# EAGLE design elektrosluch_mini_city (EAGLE 7.5.0)
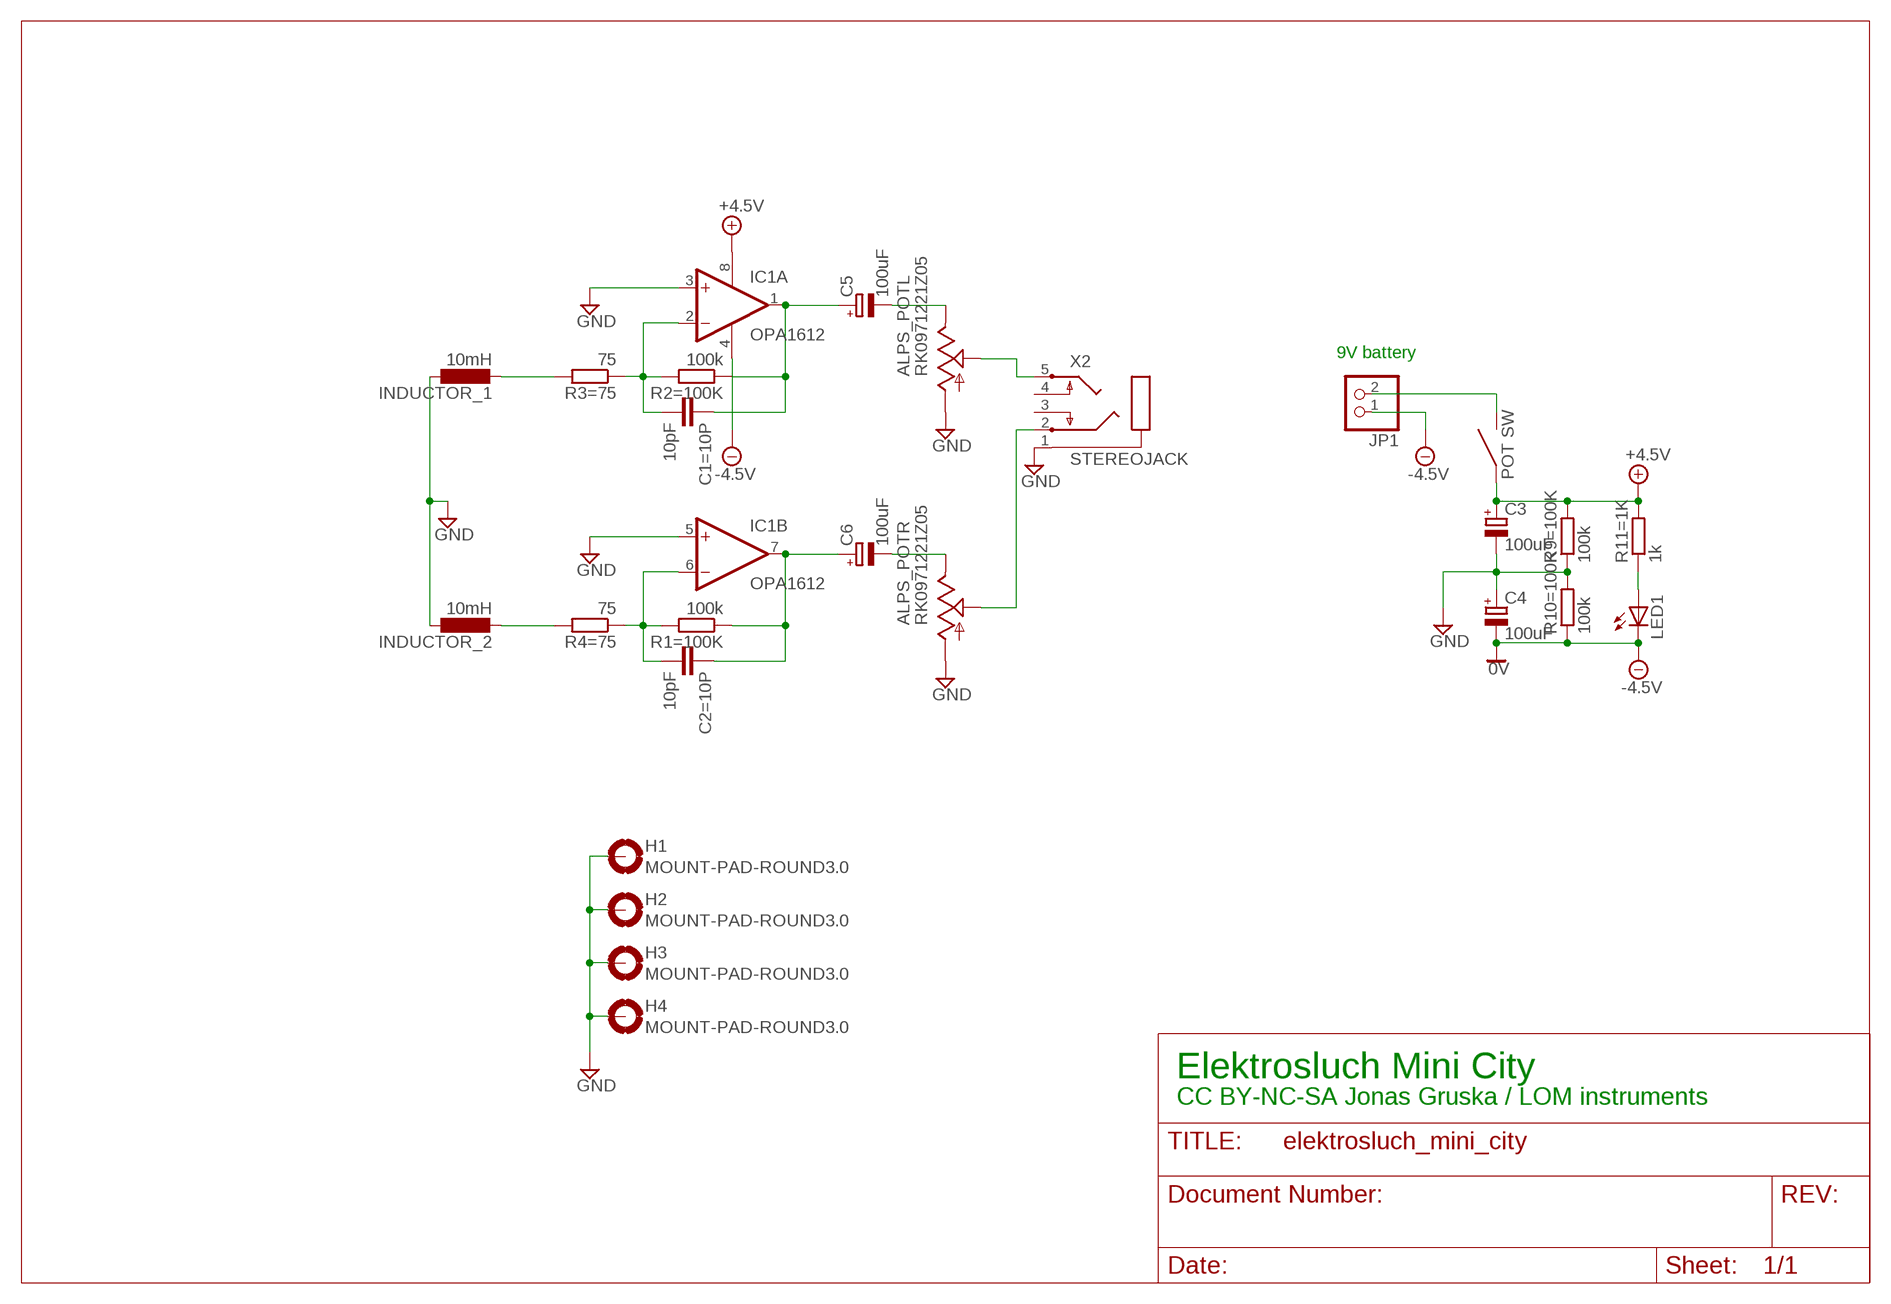
[diagram p0: schematic, sheet 1]

## Parts
ALPS_POT  RK0971221Z05  ALPS_RK0971221Z0N  [ALPS_RK0971221Z0X]
C1=10P  10pF  C-EU050-024X044  [C050-024X044]
C2=10P  10pF  C-EU050-024X044  [C050-024X044]
C3  100uF  CPOL-EUE2.5-6  [E2,5-6]
C4  100uF  CPOL-EUE2.5-6  [E2,5-6]
C5  100uF  CPOL-EUE2.5-6  [E2,5-6]
C6  100uF  CPOL-EUE2.5-6  [E2,5-6]
H1  MOUNT-PAD-ROUND3.0  [3,0-PAD]
H2  MOUNT-PAD-ROUND3.0  [3,0-PAD]
H3  MOUNT-PAD-ROUND3.0  [3,0-PAD]
H4  MOUNT-PAD-ROUND3.0  [3,0-PAD]
IC1  OPA1612  OPA2134UA  [SO08]
INDUCTOR_1  10mH  COIL  [COIL]
INDUCTOR_2  10mH  COIL  [COIL]
JP1  PINHD-1X2  [1X02]
LED1  LED3MM  [LED3MM]
R1=100K  100k  R-EU_0204/7  [0204/7]
R2=100K  100k  R-EU_0204/7  [0204/7]
R3=75  75  R-EU_0204/7  [0204/7]
R4=75  75  R-EU_0204/7  [0204/7]
R9=100K  100k  R-EU_0204/7  [0204/7]
R10=100K  100k  R-EU_0204/7  [0204/7]
R11=1K  1k  R-EU_0204/7  [0204/7]
X2  STEREOJACK  [STX3100]

## Nets
+5V: ALPS_POT.S1 C3.+ IC1.8(A:V+) R9=100K.2 R11=1K.2 ; supply symbol labelled +4.5V
-5V: C4.- IC1.4(A:V-) JP1.1 LED1.K(C) R10=100K.1 ; supply symbol labelled -4.5V, 0V
GND: ALPS_POT.G1 ALPS_POT.G2 C3.- C4.+ H1.B3,0(MOUNT) H2.B3,0(MOUNT) H3.B3,0(MOUNT) H4.B3,0(MOUNT) IC1.3(A:+IN) IC1.5(B:+IN) INDUCTOR_1.P$1 INDUCTOR_2.P$1 R9=100K.1 R10=100K.2 X2.1
N$1: C1=10P.2 IC1.2(A:-IN) R2=100K.2 R3=75.1
N$2: C1=10P.1 C5.+ IC1.1(A:OUT) R2=100K.1
N$3: ALPS_POT.I1 C5.-
N$4: C2=10P.2 IC1.6(B:-IN) R1=100K.2 R4=75.1
N$5: C2=10P.1 C6.+ IC1.7(B:OUT) R1=100K.1
N$6: ALPS_POT.I2 C6.-
N$7: ALPS_POT.O1 X2.5
N$8: INDUCTOR_1.P$2 R3=75.2
N$9: ALPS_POT.O2 X2.2
N$10: INDUCTOR_2.P$2 R4=75.2
N$14: LED1.A R11=1K.1
N$16: ALPS_POT.S2 JP1.2
Unconnected: X2.3 X2.4

## Notes on the sheet
- 9V battery
- Elektrosluch Mini City
- CC BY-NC-SA Jonas Gruska / LOM instruments

## Library data of the parts
ALPS_POT = audio-pots:ALPS_RK0971221Z0*: ALPS RK0971221Z Dual-gang 9mm potentiometer for volume control, with SPST switch -05 model: 10K with "volume" taper -0N model: 50K with traditional audio taper
C1=10P C2=10P = rcl:C-EU: CAPACITOR, European symbol
C3-C6 = rcl:CPOL-EU: POLARIZED CAPACITOR, European symbol
H1-H4 = holes:MOUNT-PAD-ROUND: MOUNTING PAD, round
IC1 = linear:OPA2*: Dual Operational Amplifier Low Power, Single-Supply, Rail-To-Rail Operational Amplifier Source: http://focus.ti.com/lit/ds/symlink/opa2345.pdf http://focus.ti.com .. opa241.pdf http://focus.ti.com/lit/ds/symlink/opa2134.pdf
INDUCTOR_1 INDUCTOR_2 = mojakniznica:COIL
JP1 = pinhead:PINHD-1X2: PIN HEADER
LED1 = led:LED: LED OSRAM: - CHIPLED LG R971, LG N971, LY N971, LG Q971, LY Q971, LO R971, LY R971 LH N974, LH R974 LS Q976, LO Q976, LY Q976 LO Q996 - Hyper CHIPLED LW Q18S LB Q993, LB Q99A, LB R99A - SideLED LS A670, LO A670, LY A670, LG A670, LP A670 LB A673, LV A673, LT A673, LW A673 LH A674 LY A675 LS A676, LA A676, LO A676, LY A676, LW A676 LS A679, LY A679, LG A679 - Hyper Micro SIDELED® LS Y876, LA Y876, LO Y876, LY Y876 LT Y87S - SmartLED LW L88C, LW L88S LB L89C, LB L89S, LG L890 LS L89K, LO L89K, LY L89K LS L896, LA L896, LO L896, LY L896 - TOPLED LS T670, LO T670, LY T670, LG T670, LP T670 LSG T670, LSP T670, LSY T670, LOP T670, LYG T670 LG T671, LOG T671, LSG T671 LB T673, LV T673, LT T673, LW T673 LH T674 LS T676, LA T676, LO T676, LY T676, LB T676, LH T676, LSB T676, LW T676 LB T67C, LV T67C, LT T67C, LS T67K, LO T67K, LY T67K, LW E67C LS E67B, LA E67B, LO E67B, LY E67B, LB E67C, LV E67C, LT E67C LW T67C LS T679, LY T679, LG T679 LS T770, LO T770, LY T770, LG T770, LP T770 LB T773, LV T773, LT T773, LW T773 LH T774 LS E675, LA E675, LY E675, LS T675 LS T776, LA T776, LO T776, LY T776, LB T776 LHGB T686 LT T68C, LB T68C - Hyper Mini TOPLED® LB M676 - Mini TOPLED Santana® LG M470 LS M47K, LO M47K, LY M47K Source: http://www.osram.convergy.de LUXEON: - LUMILED® LXK2-PW12-R00, LXK2-PW12-S00, LXK2-PW14-U00, LXK2-PW14-V00 LXK2-PM12-R00, LXK2-PM12-S00, LXK2-PM14-U00 LXK2-PE12-Q00, LXK2-PE12-R00, LXK2-PE12-S00, LXK2-PE14-T00, LXK2-PE14-U00 LXK2-PB12-K00, LXK2-PB12-L00, LXK2-PB12-M00, LXK2-PB14-N00, LXK2-PB14-P00, LXK2-PB14-Q00 LXK2-PR12-L00, LXK2-PR12-M00, LXK2-PR14-Q00, LXK2-PR14-R00 LXK2-PD12-Q00, LXK2-PD12-R00, LXK2-PD12-S00 LXK2-PH12-R00, LXK2-PH12-S00 LXK2-PL12-P00, LXK2-PL12-Q00, LXK2-PL12-R00 Source: www.luxeon.com KINGBRIGHT: KA-3528ASYC Source: www.kingbright.com
R1=100K R2=100K R3=75 R4=75 R9=100K R10=100K R11=1K = rcl:R-EU_: RESISTOR, European symbol
X2 = adafruit:STEREOJACK: MIC/HEADPHONE JACK Stereo jack with two switches. Kycon STX3100, CUI SJ1-3555NG and/or 4UCon 05544

## Board
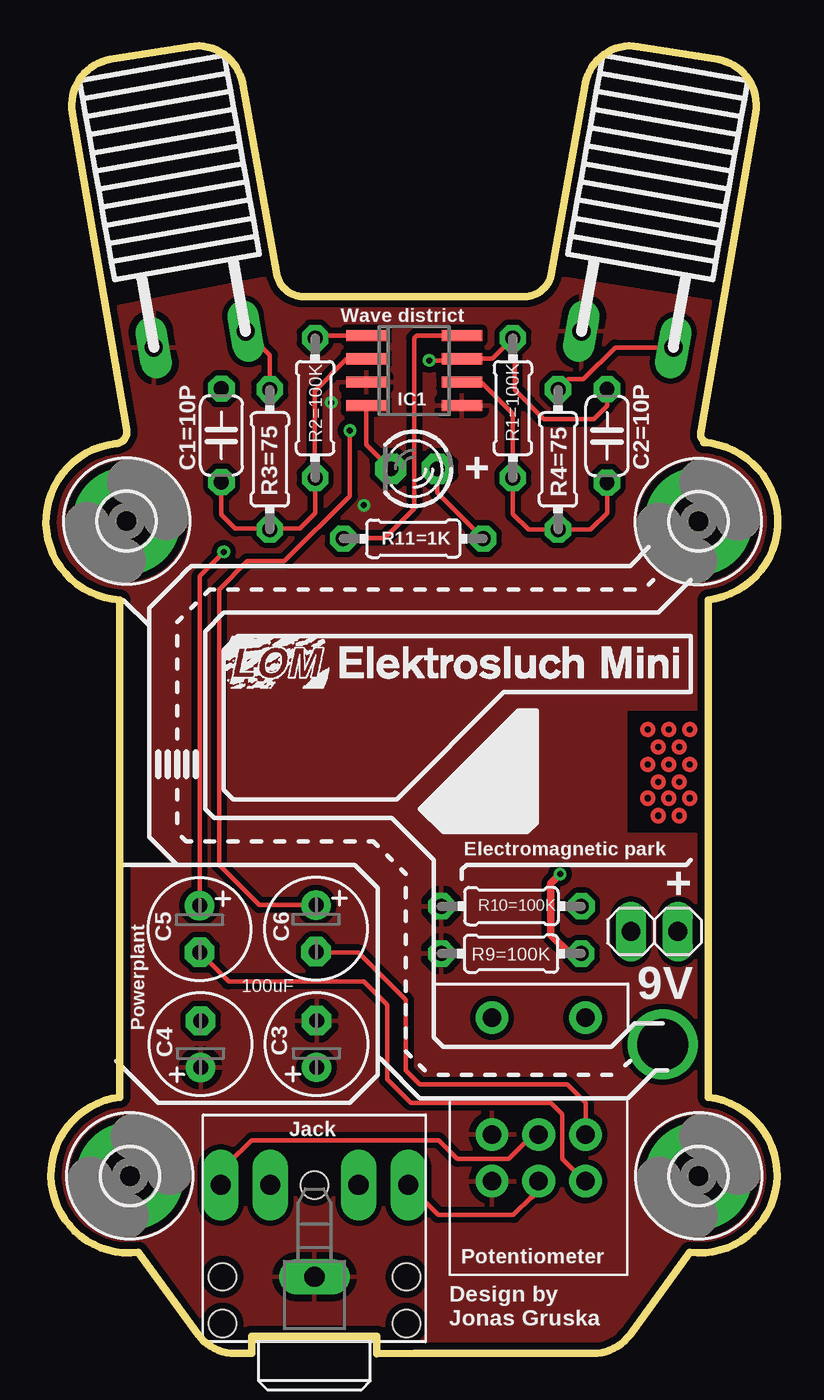
[diagram p1: board, top side]
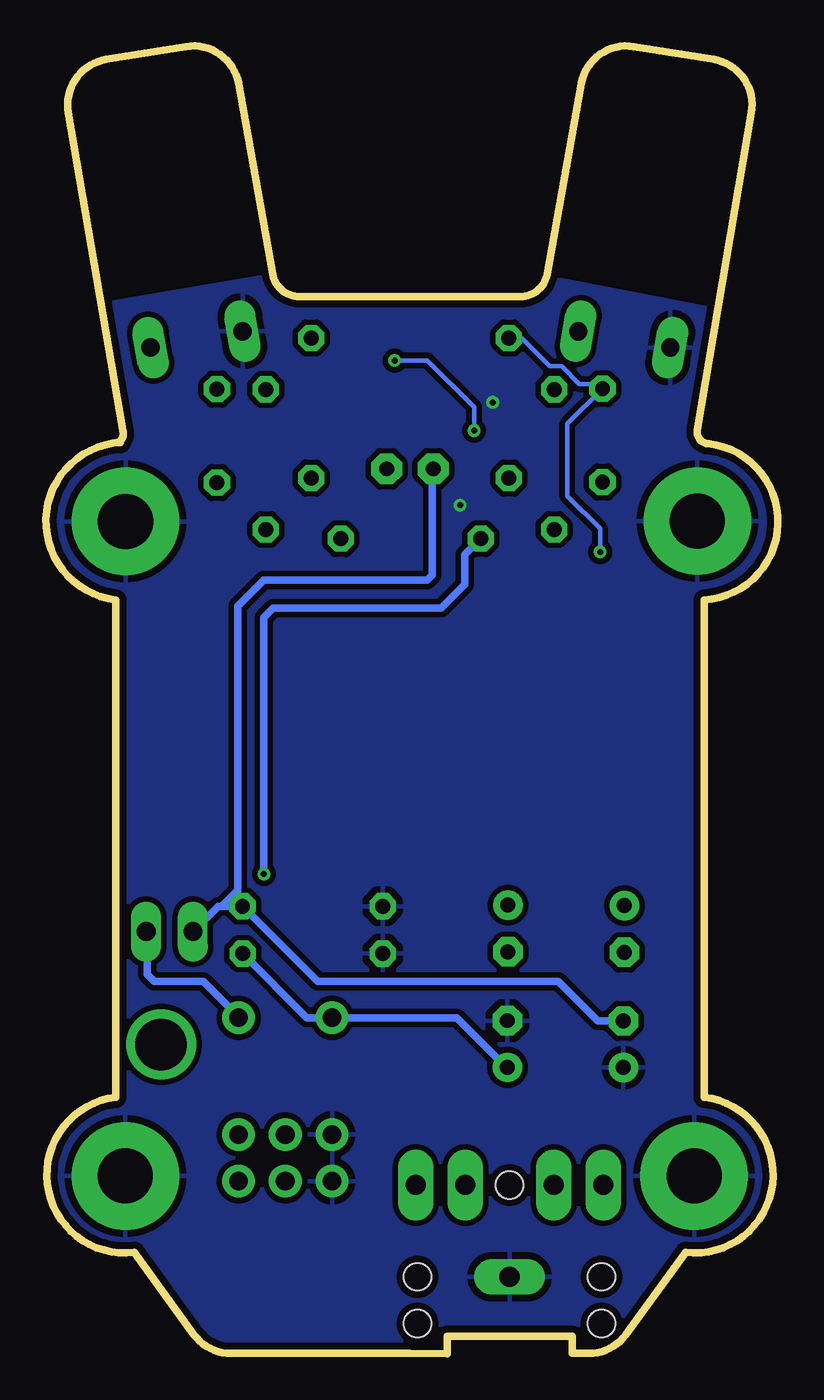
[diagram p2: board, bottom side, seen from below]

Size 39.81 x 71.14 mm. Coordinates in mm from the lower left corner, seen from the top.
Outline: 3.76,49.5 arc170 4.02,41 4.02,13.94 arc180 5.02,5.5 8.27,1.03 arc54 10.29,0 11.19,0 11.19,0.94 17.99,0.94 17.99,0 20.02,0 29.75,0 arc54 31.77,1.03 35.02,5.5 arc180 36.02,13.94 36.02,41 arc170 35.76,49.57
Outline: 3.77,49.5 arc100 4.39,50.24 1.44,67.52 arc-90 3.51,70.41 7.84,71.11 arc-89 10.7,69.08 12.55,58.73 arc80 14.02,57.5 20.02,57.5 26.02,57.5 arc80 27.49,58.73 29.34,69.08 arc-89 32.2,71.11 36.53,70.41 arc-90 38.59,67.52 35.64,50.24 arc100 35.95,49.57
Copper layers (1*16): Top 0.0356mm / dielectric 1.5011mm / Bottom 0.0356mm
Design rules "LaenPCBOrder *": minimum track width 6mil, minimum drill 13mil, track to track 6mil, track to pad 6mil, pad to pad 6mil, via to via 6mil, smd to smd 6mil, copper to edge 15mil, drill to drill 6mil, minimum pad ring 12mil, minimum via ring 7mil, stop-mask expansion 3mil, vias tented up to drill 0mil, thermal gap 15mil

### Footprints (pad centres in the part's own frame; a part is rotated, then mirrored left to right if it is on the bottom)
ALPS_RK0971221Z0X = drill 1.016 pad 1.778: G1 10.693,2.261; G2 8.153,2.261; I1 10.693,7.341; I2 8.153,7.341; O1 10.693,4.801; O2 8.153,4.801; S1 1.803,2.261; S2 1.803,7.341
C050-024X044 = drill 0.813 octagon: 1 -2.54,0; 2 2.54,0
E2,5-6 = drill 0.813 pad 1.6: + -1.27,0 | drill 0.813 pad 1.6 octagon: - 1.27,0
3,0-PAD = drill 3 pad 5.842: B3,0 0,0
SO08 = smd 0.6 x 2.2: 1 -1.905,-2.6; 2 -0.635,-2.6; 3 0.635,-2.6; 4 1.905,-2.6; 5 1.905,2.6; 6 0.635,2.6; 7 -0.635,2.6; 8 -1.905,2.6
COIL = drill 1 pad 1.676 long: P$1 -2.54,0; P$2 2.54,0
1X02 = drill 1.016 long: 1 -1.27,0; 2 1.27,0
LED3MM = drill 0.813 pad 1.676 octagon: A -1.27,0; K 1.27,0
0204/7 = drill 0.813 octagon: 1 -3.81,0; 2 3.81,0
STX3100 = drill 1.1 pad 1.93 long: 1 2.7,-0.1; 2 7.7,5; 3 7.7,2.3; 4 7.7,-2.5; 5 7.7,-5.2 | hole 1.5: 2.7,4.9; 2.7,-5.1; 7.7,-0.1; 2.7,4.9; 0.16,4.9; 2.7,-5.1; 0.16,-5.1

### Placement (x,y rotation side)
ALPS_POT  22,20.07 270 top
C1=10P  9.54,49.95 270 top
C2=10P  30.51,49.93 270 top
C3  14.72,16.84 90 top
C4  8.41,16.83 90 top
C5  8.36,23.1 270 top
C6  14.69,23.13 270 top
H1  35.49,9.67 0 top
H2  4.56,9.67 0 top
H3  35.48,45.27 0 top
H4  4.38,45.29 0 top
IC1  20.02,53.48 270 top
INDUCTOR_1  8.36,55.18 10 top
INDUCTOR_2  31.62,55.18 350 top
JP1  33.09,22.96 0 top
LED1  20.02,48.13 180 top
R1=100K  25.39,51.44 270 top
R2=100K  14.64,51.44 270 top
R3=75  12.17,48.65 90 top
R4=75  27.85,48.65 90 top
R9=100K  25.3,21.76 0 top
R10=100K  25.31,24.34 180 top
R11=1K  19.98,44.34 180 top
U$1  [ELEKTROSLUCHMINI]  9.67,39.55 0 top
X2  14.5,1.47 90 top

### Tracks (layer width: path | path; a pad name or v marks a point on that pad's centre or on a via)
+5V  (via drill 0.33)
  Top 0.254: IC1.8 20.18,55.39 20.02,55.23 20.02,49.64 20.02,49.26 20.02,48.88 20.02,45.96 18.43,44.37 18.31,44.37 16.21,44.37 R11=1K.2
  Top 0.406: 28.97,21.77 28.98,21.76 R9=100K.2 28.48,21.76 27.45,22.78 27.45,25.58 v27.96,26.09
  Bottom 0.406: v27.96,26.09 27.96,40.06 27.45,40.56 18.31,40.56 17.04,41.83 17.04,43.47 R11=1K.2 | R9=100K.2 25.62,18.27 ALPS_POT.S1 23.87,18.27 17.48,18.27 14.78,15.57 C3.+
-5V
  Top 0.254: LED1.K 17.42,49.46 IC1.4
  Bottom 0.406: 30.24,24.34 R10=100K.1 25.03,20.24 11.96,20.24 9.81,18.1 C4.- | 30.24,24.34 30.45,24.34 JP1.1 | LED1.K 18.81,48.06 18.81,42.34 19.07,42.09 27.96,42.09 29.38,40.67 29.38,25.2 30.24,24.34
GND  (via drill 0.33)
  other vias: 17.29,46.15 15.51,51.74
  pour Bottom (isolate 0.305): -5.06,58.34 1.8,58.34 3.57,56.82 12.72,58.6 27.96,58.6 36.85,57.07 36.85,57.33 38.37,58.6 48.28,58.34 48.28,-7.7 -5.06,-7.7
  pour Top (isolate 0.305): 0.02,58.34 1.8,58.34 3.32,56.82 12.46,58.6 27.45,58.6 37.1,57.07 50.31,58.47 50.44,58.47 50.56,35.1 31.51,35.1 31.51,28.24 50.82,28.12 50.31,-7.57 -2.97,-8.01 0.97,26.28 7.07,26.59 5.61,28.12 5.61,39.67 4.08,41.07 2.81,40.31 0.02,40.31
N$1
  Top 0.254: 12.22,44.88 13.8,44.88 14.64,45.72 R2=100K.2 14.62,47.63 14.62,52.37 16.34,54.09 17.4,54.09 IC1.2 | 12.22,44.88 R3=75.1 | 12.22,44.88 10.31,44.88 9.54,45.64 C1=10P.2 | C1=10P.2
N$2  (via drill 0.33)
  Top 0.254: IC1.1 14.78,55.39 R2=100K.1 | C5.+ 8.36,42.3 v9.67,43.61
  Bottom 0.254: v9.67,43.61 9.67,44.88 11.45,46.66 11.45,50.59 C1=10P.1 9.81,52.76 10.81,52.76 11.77,53.71 12.4,53.71 12.46,53.77 13.94,55.25 R2=100K.1
N$3
  Top 0.254: ALPS_POT.I1 29.34,9.34 28.09,10.59 28.09,13 27.45,13.64 19.83,13.64 18.56,14.91 18.56,18.97 17.29,20.24 9.94,20.24 C5.-
N$4
  Top 0.254: C2=10P.2 30.51,45.72 29.61,44.82 27.87,44.82 R4=75.1 27.83,44.82 26.24,44.82 25.39,45.67 R1=100K.2 25.39,51.13 23.7,52.82 22.65,52.82 IC1.6
N$5  (via drill 0.33)
  Top 0.254: 23.13,54.12 IC1.7 22.53,54.03 v20.85,54.03 | 23.13,54.12 24.26,54.12 R1=100K.1 25.48,55.16 25.48,52.44 27.07,50.85 29.8,50.85 30.51,51.56 C2=10P.1 | C6.+ 11.61,24.4 9.42,26.59 9.42,41.58 10.94,43.1 12.97,43.1 16.53,46.66 v16.53,50.22 | 23.04,54.03 23.13,54.12
  Bottom 0.254: v16.53,50.22 16.53,50.98 16.53,51.49 19.07,54.03 v20.85,54.03
N$6
  Top 0.254: ALPS_POT.I2 29.36,11.89 29.36,13.64 28.34,14.66 20.34,14.66 19.58,15.42 19.58,19.23 16.97,21.83 14.71,21.83 C6.-
N$7
  Top 0.254: 26.41,8.54 25.42,7.54 21.33,7.54 X2.5
  Top 0.305: 26.41,8.54 26.8,8.92 ALPS_POT.O1
N$8
  Top 0.254: R3=75.2 12.17,54.31 INDUCTOR_1.P$2
N$9
  Top 0.254: X2.2 9.92,9.22 9.92,10.34 11.19,11.61 12.32,11.61 21.35,11.61 22.37,10.59 25.16,10.59 26.49,11.92 ALPS_POT.O2
N$10
  Top 0.254: R4=75.2 28.4,53.01 28.97,53.01 29.23,53.01 30.95,54.74 INDUCTOR_2.P$2
N$11  (via drill 2.79)
  other vias: 33.55,16.81
N$14
  Top 0.254: LED1.A 21.29,46.84 R11=1K.1
N$16
  Bottom 0.406: JP1.2 34.31,22.91 34.31,21.01 34.31,20.62 33.93,20.24 31.26,20.24 29.34,18.32 ALPS_POT.S2
(copper drawn outside any net)
  shapes: Top circle x15

### Text on the board
tNames: Wave district | + | Electromagnetic park | + | 100uF | 9V | Powerplant | Jack | Potentiometer | Design by / Jonas Gruska
tValues: LED
tStop: CITY
bStop: Battery holder / belongs here | lom.audio / 09.2016